# EAGLE design le_grand_strum (EAGLE 6.6.0)
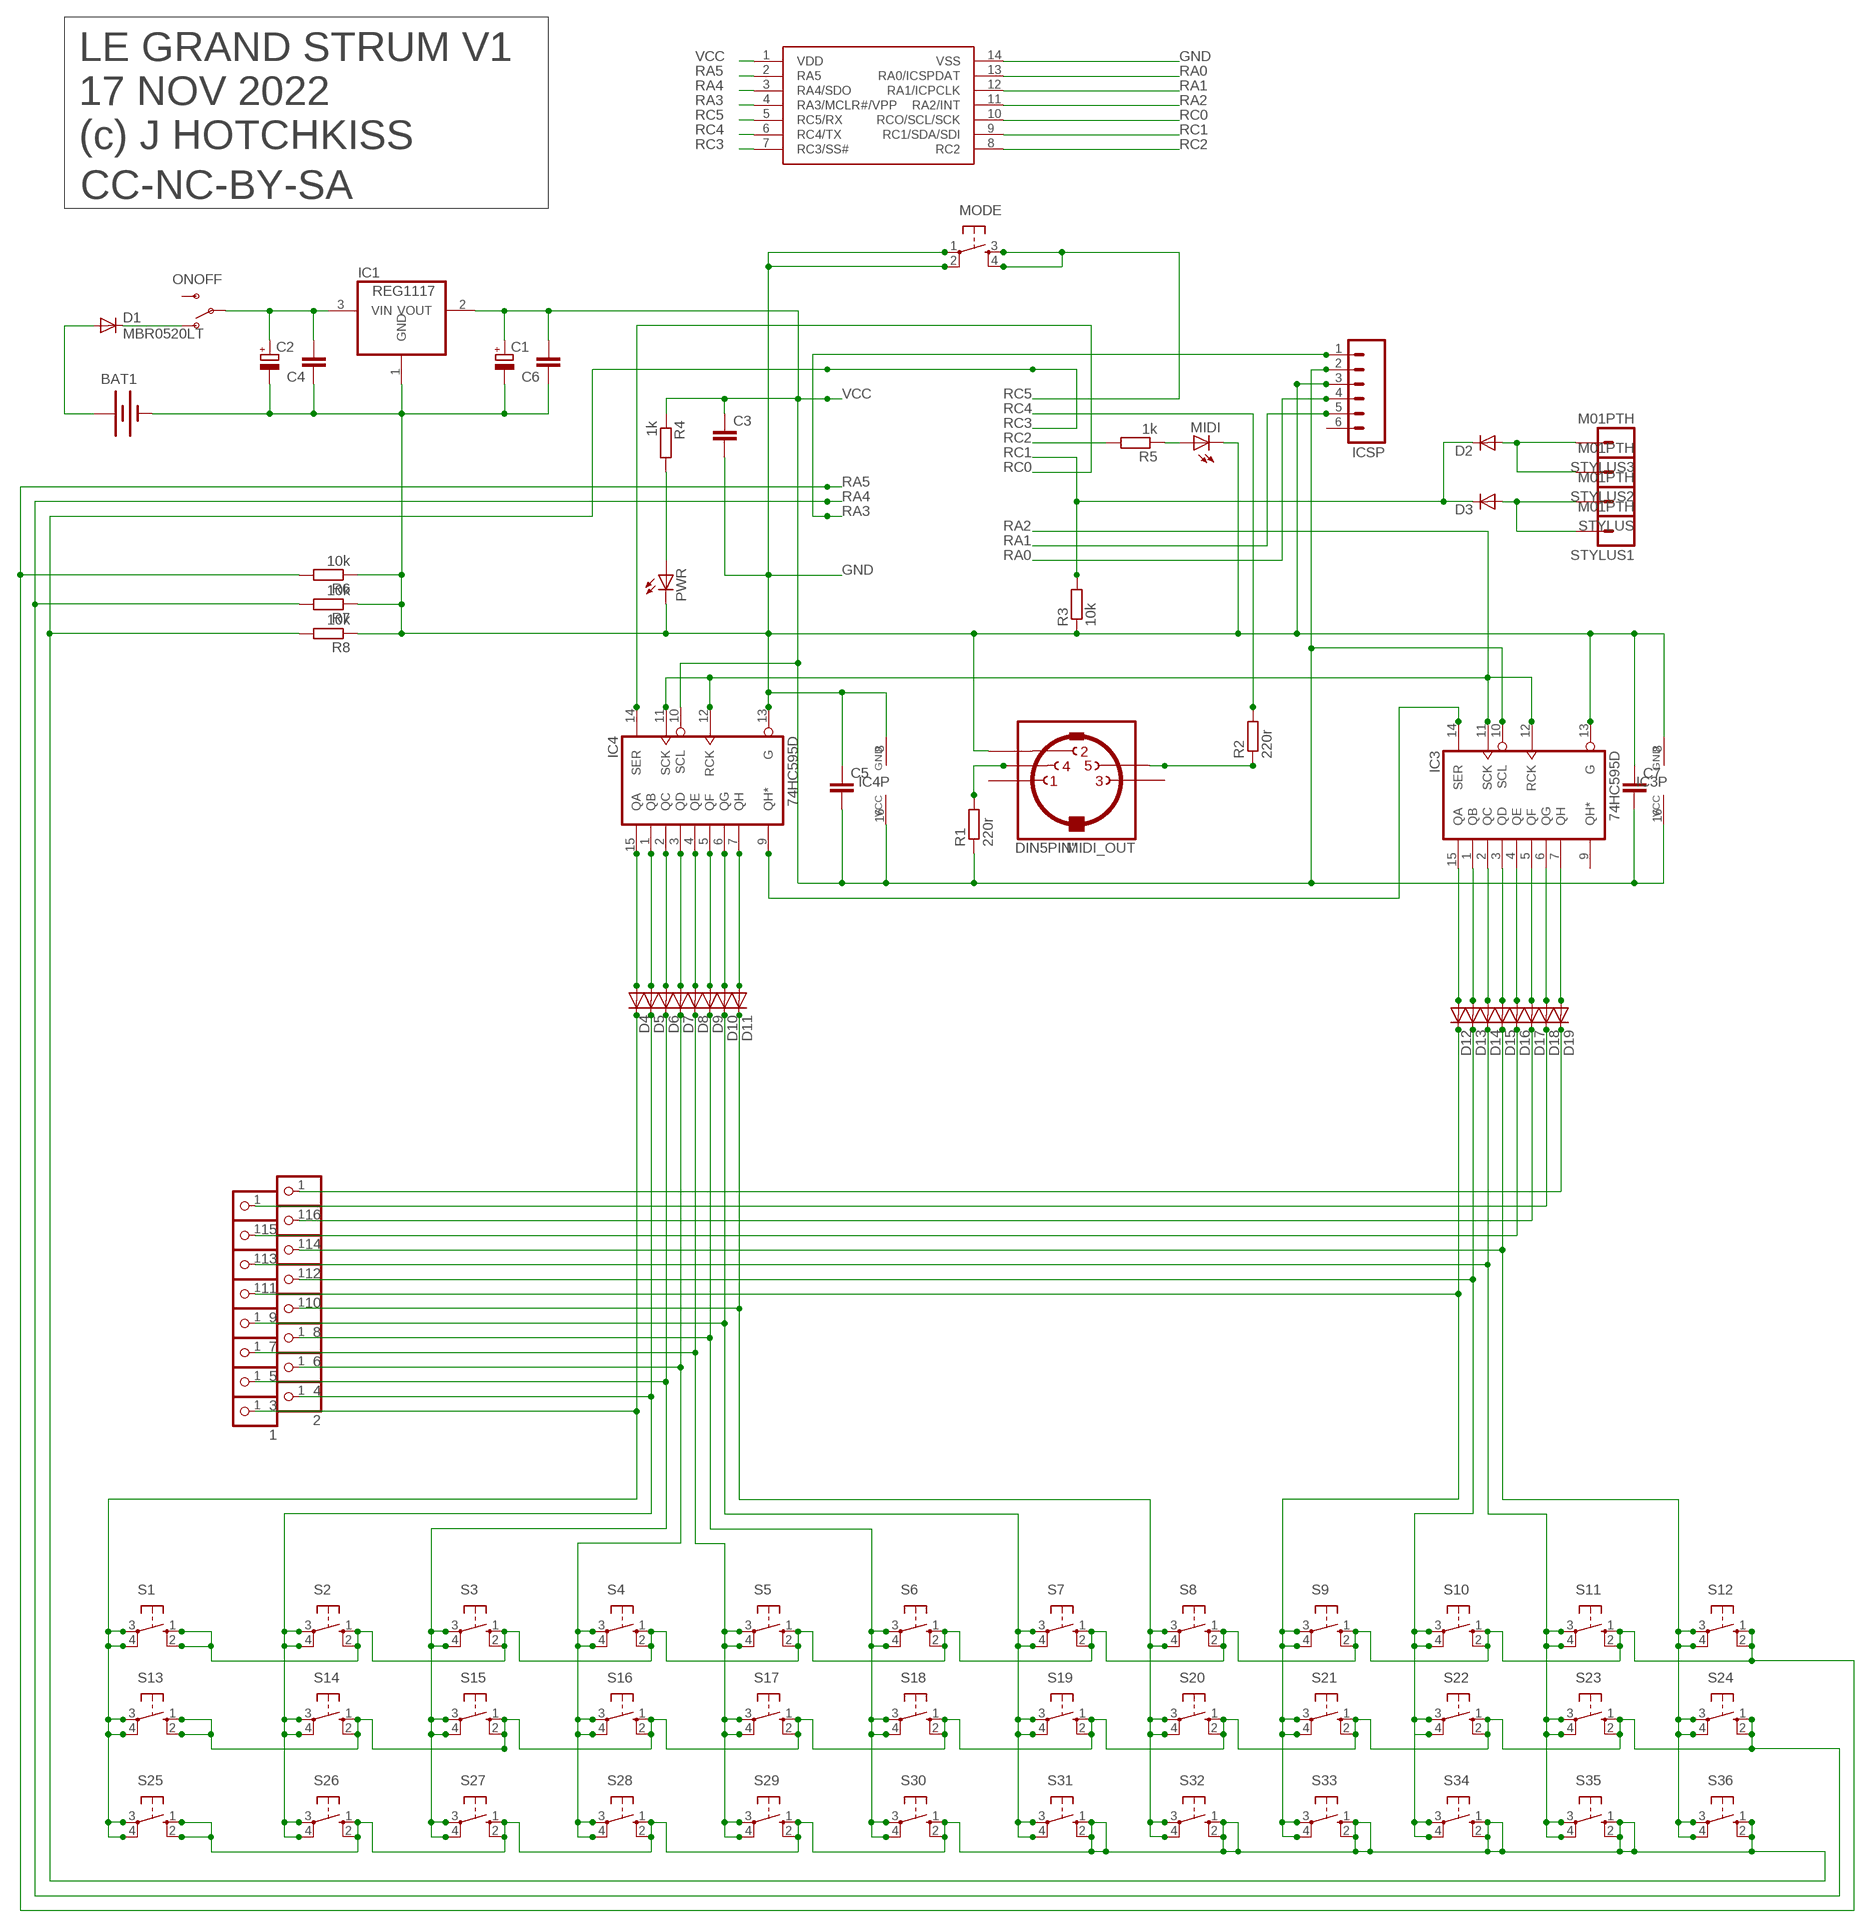
[diagram p0: schematic, sheet 1]

## Parts
1  PINHD-1X1  [1X01]
2  PINHD-1X1  [1X01]
3  PINHD-1X1  [1X01]
4  PINHD-1X1  [1X01]
5  PINHD-1X1  [1X01]
6  PINHD-1X1  [1X01]
7  PINHD-1X1  [1X01]
8  PINHD-1X1  [1X01]
9  PINHD-1X1  [1X01]
10  PINHD-1X1  [1X01]
11  PINHD-1X1  [1X01]
12  PINHD-1X1  [1X01]
13  PINHD-1X1  [1X01]
14  PINHD-1X1  [1X01]
15  PINHD-1X1  [1X01]
16  PINHD-1X1  [1X01]
BAT1  BATTERY2HOLES  [PP3_BATTERBOX2]
C1  CPOL-EUE2-5  [E2-5]
C2  CPOL-EUE2-5  [E2-5]
C3  C-EUC0805  [C0805]
C4  C-EUC0805  [C0805]
C5  C-EUC0805  [C0805]
C6  C-EUC0805  [C0805]
C7  C-EUC0805  [C0805]
D1  MBR0520LT  [SOD123]
D2  TS4148  [D0805]
D3  TS4148  [D0805]
D4  TS4148  [D0805]
D5  TS4148  [D0805]
D6  TS4148  [D0805]
D7  TS4148  [D0805]
D8  TS4148  [D0805]
D9  TS4148  [D0805]
D10  TS4148  [D0805]
D11  TS4148  [D0805]
D12  TS4148  [D0805]
D13  TS4148  [D0805]
D14  TS4148  [D0805]
D15  TS4148  [D0805]
D16  TS4148  [D0805]
D17  TS4148  [D0805]
D18  TS4148  [D0805]
D19  TS4148  [D0805]
IC1  REG1117  [SOT223]
IC2  PIC16F1825SO14  [SO14]
IC3  74HC595D  [SO16]
IC4  74HC595D  [SO16]
ICSP  M06SIP  [1X06]
MIDI  LEDCHIPLED_0805  [CHIPLED_0805]
MIDI_OUT  DIN5PIN"  [TRUCONN90]
MODE  TAC_SWITCHPTH  [TACTILE-PTH]
ONOFF  SWITCH-SPSTPTH  [SWITCH-SPDT]
PWR  LEDCHIPLED_0805  [CHIPLED_0805]
R1  220r  R-EU_R0805  [R0805]
R2  220r  R-EU_R0805  [R0805]
R3  10k  R-EU_R0805  [R0805]
R4  1k  R-EU_R0805  [R0805]
R5  1k  R-EU_R0805  [R0805]
R6  10k  R-EU_R0805  [R0805]
R7  10k  R-EU_R0805  [R0805]
R8  10k  R-EU_R0805  [R0805]
S1  40-XX  [B3F-40XX]
S2  40-XX  [B3F-40XX]
S3  40-XX  [B3F-40XX]
S4  40-XX  [B3F-40XX]
S5  40-XX  [B3F-40XX]
S6  40-XX  [B3F-40XX]
S7  40-XX  [B3F-40XX]
S8  40-XX  [B3F-40XX]
S9  40-XX  [B3F-40XX]
S10  40-XX  [B3F-40XX]
S11  40-XX  [B3F-40XX]
S12  40-XX  [B3F-40XX]
S13  40-XX  [B3F-40XX]
S14  40-XX  [B3F-40XX]
S15  40-XX  [B3F-40XX]
S16  40-XX  [B3F-40XX]
S17  40-XX  [B3F-40XX]
S18  40-XX  [B3F-40XX]
S19  40-XX  [B3F-40XX]
S20  40-XX  [B3F-40XX]
S21  40-XX  [B3F-40XX]
S22  40-XX  [B3F-40XX]
S23  40-XX  [B3F-40XX]
S24  40-XX  [B3F-40XX]
S25  40-XX  [B3F-40XX]
S26  40-XX  [B3F-40XX]
S27  40-XX  [B3F-40XX]
S28  40-XX  [B3F-40XX]
S29  40-XX  [B3F-40XX]
S30  40-XX  [B3F-40XX]
S31  40-XX  [B3F-40XX]
S32  40-XX  [B3F-40XX]
S33  40-XX  [B3F-40XX]
S34  40-XX  [B3F-40XX]
S35  40-XX  [B3F-40XX]
S36  40-XX  [B3F-40XX]
STYLUS  M01PTH  [1X01]
STYLUS1  M01PTH  [1X01]
STYLUS2  M01PTH  [1X01]
STYLUS3  M01PTH  [1X01]

## Nets
CARRY: IC3.14(SER) IC4.9(QH*)
GND: BAT1.0V(-) C1.- C2.- C3.2 C4.1 C5.1 C6.1 C7.1 IC1.1(GND) IC2.14(VSS) IC3.8(GND) IC3.13(G) IC4.8(GND) IC4.13(G) ICSP.3 MIDI.C MIDI_OUT.2 MODE.1 MODE.2 PWR.C R3.1 R6.1 R7.1 R8.1
LINE1: 1.1 D4.K(C) S1.3(P) S1.4(P1) S13.3(P) S13.4(P1) S25.3(P) S25.4(P1)
LINE2: 2.1 D5.K(C) S2.3(P) S2.4(P1) S14.3(P) S14.4(P1) S26.3(P) S26.4(P1)
LINE3: 3.1 D6.K(C) S3.3(P) S3.4(P1) S15.3(P) S15.4(P1) S27.3(P) S27.4(P1)
LINE4: 4.1 D7.K(C) S4.3(P) S4.4(P1) S16.3(P) S16.4(P1) S28.3(P) S28.4(P1)
LINE5: 5.1 D8.K(C) S5.3(P) S5.4(P1) S17.3(P) S17.4(P1) S29.3(P) S29.4(P1)
LINE6: 6.1 D9.K(C) S6.3(P) S6.4(P1) S18.3(P) S18.4(P1) S30.3(P) S30.4(P1)
LINE7: 7.1 D10.K(C) S7.3(P) S7.4(P1) S19.3(P) S19.4(P1) S31.3(P) S31.4(P1)
LINE8: 8.1 D11.K(C) S8.3(P) S8.4(P1) S20.3(P) S20.4(P1) S32.3(P) S32.4(P1)
LINE9: 9.1 D12.K(C) S9.3(P) S9.4(P1) S21.3(P) S21.4(P1) S33.3(P) S33.4(P1)
LINE10: 10.1 D13.K(C) S10.3(P) S10.4(P1) S22.3(P) S22.4(P1) S34.3(P) S34.4(P1)
LINE11: 11.1 D14.K(C) S11.3(P) S11.4(P1) S23.3(P) S23.4(P1) S35.3(P) S35.4(P1)
LINE12: 12.1 D15.K(C) S12.3(P) S12.4(P1) S24.3(P) S24.4(P1) S36.3(P) S36.4(P1)
LINE13: 13.1 D16.K(C)
LINE14: 14.1 D17.K(C)
LINE15: 15.1 D18.K(C)
LINE16: 16.1 D19.K(C)
N$1: PWR.A R4.2
N$2: BAT1.9V(+) D1.A
N$3: D1.C ONOFF.1(O)
N$5: D4.A IC4.15(QA)
N$6: D5.A IC4.1(QB)
N$7: D6.A IC4.2(QC)
N$8: D7.A IC4.3(QD)
N$9: D8.A IC4.4(QE)
N$10: D9.A IC4.5(QF)
N$11: D10.A IC4.6(QG)
N$12: MIDI.A R5.1
N$13: D11.A IC4.7(QH)
N$14: D12.A IC3.15(QA)
N$15: D13.A IC3.1(QB)
N$16: D14.A IC3.2(QC)
N$17: D15.A IC3.3(QD)
N$18: D16.A IC3.4(QE)
N$19: D17.A IC3.5(QF)
N$20: D18.A IC3.6(QG)
N$21: D19.A IC3.7(QH)
N$24: D2.A STYLUS2.1 STYLUS3.1
N$25: D3.A STYLUS1.1 STYLUS.1
N$44: MIDI_OUT.5 R2.1
N$48: MIDI_OUT.4 R1.2
N$59: C2.+ C4.2 IC1.3(VIN) ONOFF.2(P)
RA0: IC2.13(RA0/ICSPDAT) ICSP.4
RA1: IC2.12(RA1/ICPCLK) ICSP.5
RA2: IC2.11(RA2/INT) IC3.11(SCK) IC3.12(RCK) IC4.11(SCK) IC4.12(RCK)
RA3: IC2.4(RA3/MCLR#/VPP) ICSP.1
RA4: IC2.3(RA4/SDO) R7.2 S13.1(S) S13.2(S1) S14.1(S) S14.2(S1) S15.1(S) S15.2(S1) S16.1(S) S16.2(S1) S17.1(S) S17.2(S1) S18.1(S) S18.2(S1) S19.1(S) S19.2(S1) S20.1(S) S20.2(S1) S21.1(S) S21.2(S1) S22.1(S) S22.2(S1) S23.1(S) S23.2(S1) S24.1(S) S24.2(S1)
RA5: IC2.2(RA5) R6.2 S1.1(S) S1.2(S1) S2.1(S) S2.2(S1) S3.1(S) S3.2(S1) S4.1(S) S4.2(S1) S5.1(S) S5.2(S1) S6.1(S) S6.2(S1) S7.1(S) S7.2(S1) S8.1(S) S8.2(S1) S9.1(S) S9.2(S1) S10.1(S) S10.2(S1) S11.1(S) S11.2(S1) S12.1(S) S12.2(S1)
RC0: IC2.10(RCO/SCL/SCK) IC4.14(SER)
RC1: D2.K(C) D3.K(C) IC2.9(RC1/SDA/SDI) R3.2
RC2: IC2.8(RC2) R5.2
RC3: IC2.7(RC3/SS#) R8.2 S25.1(S) S25.2(S1) S26.1(S) S26.2(S1) S27.1(S) S27.2(S1) S28.1(S) S28.2(S1) S29.1(S) S29.2(S1) S30.1(S) S30.2(S1) S31.1(S) S31.2(S1) S32.1(S) S32.2(S1) S33.1(S) S33.2(S1) S34.1(S) S34.2(S1) S35.1(S) S35.2(S1) S36.1(S) S36.2(S1)
RC4: IC2.6(RC4/TX) R2.2
RC5: IC2.5(RC5/RX) MODE.3 MODE.4
VCC: C1.+ C3.1 C5.2 C6.2 C7.2 IC1.2(VOUT) IC2.1(VDD) IC3.10(SCL) IC3.16(VCC) IC4.10(SCL) IC4.16(VCC) ICSP.2 R1.1 R4.1
Unconnected: IC3.9(QH*) ICSP.6 MIDI_OUT.1 MIDI_OUT.3 ONOFF.3(S)

## Notes on the sheet
- LE GRAND STRUM V1
- 17 NOV 2022
- (c) J HOTCHKISS
- CC-NC-BY-SA

## Library data of the parts
1-16 = pinhead:PINHD-1X1: PIN HEADER
BAT1 = jasons_stuff:BATTERY: Battery Holders Various common sizes : AA, AAA, 20mm coin cell and 12mm coin cell.
C1 C2 = rcl:CPOL-EU: POLARIZED CAPACITOR, European symbol
C3-C7 = rcl:C-EU: CAPACITOR, European symbol
D1 = diode:MBR0520LT: SCHOTTKY BARRIER RECTIFIER Source: http://onsemi.com .. MBR0520LT1-D.pdf
D2-D19 = jason_eagle6:TS4148
IC1 = burr-brown:REG1117: 800mA and 1A Low Dropout (LDO) Positive Regulator 1.8V, 2.5V, 2.85V, 3.3V, 5V, and Adj; MPN: REG1117; OC_FARNELL: 1097566; OC_NEWARK: 14P6981
IC2 = jasons_stuff:PIC16F1825
IC3 IC4 = 74xx-eu:74*595: 8-bit SHIFT REGISTER, output latch
ICSP = SparkFun:M06: Header 6 Standard 6-pin 0.1" header. Use with straight break away headers (SKU : PRT-00116), right angle break away headers (PRT-00553), swiss pins (PRT-00743), machine pins (PRT-00117), and female headers (PRT-00115). Molex polarized connector foot print use with SKU : PRT-08094 with associated crimp pins and housings. NOTES ON THE VARIANTS LOCK and LOCK_LONGPADS... This footprint was designed to help hold the alignment of a through-hole component (i.e. 6-pin header) while soldering it into place. You may notice that each hole has been shifted either up or down by 0.005 of an inch from it's more standard position (which is a perfectly straight line). This slight alteration caused the pins (the squares in the middle) to touch the edges of the holes. Because they are alternating, it causes a "brace" to hold the component in place. 0.005 has proven to be the perfect amount of "off-center" position when using our standard breakaway headers. Although looks a little odd when you look at the bare footprint, once you have a header in there, the alteration is very hard to notice. Also, if you push a header all the way into place, it is covered up entirely on the bottom side. This idea of altering the position of holes to aid alignment will be further integrated into the Sparkfun Library for other footprints. It can help hold any component with 3 or more connection pins.
MIDI PWR = led:LED: LED OSRAM: - CHIPLED LG R971, LG N971, LY N971, LG Q971, LY Q971, LO R971, LY R971 LH N974, LH R974 LS Q976, LO Q976, LY Q976 LO Q996 - Hyper CHIPLED LW Q18S LB Q993, LB Q99A, LB R99A - SideLED LS A670, LO A670, LY A670, LG A670, LP A670 LB A673, LV A673, LT A673, LW A673 LH A674 LY A675 LS A676, LA A676, LO A676, LY A676, LW A676 LS A679, LY A679, LG A679 - Hyper Micro SIDELED® LS Y876, LA Y876, LO Y876, LY Y876 LT Y87S - SmartLED LW L88C, LW L88S LB L89C, LB L89S, LG L890 LS L89K, LO L89K, LY L89K LS L896, LA L896, LO L896, LY L896 - TOPLED LS T670, LO T670, LY T670, LG T670, LP T670 LSG T670, LSP T670, LSY T670, LOP T670, LYG T670 LG T671, LOG T671, LSG T671 LB T673, LV T673, LT T673, LW T673 LH T674 LS T676, LA T676, LO T676, LY T676, LB T676, LH T676, LSB T676, LW T676 LB T67C, LV T67C, LT T67C, LS T67K, LO T67K, LY T67K, LW E67C LS E67B, LA E67B, LO E67B, LY E67B, LB E67C, LV E67C, LT E67C LW T67C LS T679, LY T679, LG T679 LS T770, LO T770, LY T770, LG T770, LP T770 LB T773, LV T773, LT T773, LW T773 LH T774 LS E675, LA E675, LY E675, LS T675 LS T776, LA T776, LO T776, LY T776, LB T776 LHGB T686 LT T68C, LB T68C - Hyper Mini TOPLED® LB M676 - Mini TOPLED Santana® LG M470 LS M47K, LO M47K, LY M47K Source: http://www.osram.convergy.de LUXEON: - LUMILED® LXK2-PW12-R00, LXK2-PW12-S00, LXK2-PW14-U00, LXK2-PW14-V00 LXK2-PM12-R00, LXK2-PM12-S00, LXK2-PM14-U00 LXK2-PE12-Q00, LXK2-PE12-R00, LXK2-PE12-S00, LXK2-PE14-T00, LXK2-PE14-U00 LXK2-PB12-K00, LXK2-PB12-L00, LXK2-PB12-M00, LXK2-PB14-N00, LXK2-PB14-P00, LXK2-PB14-Q00 LXK2-PR12-L00, LXK2-PR12-M00, LXK2-PR14-Q00, LXK2-PR14-R00 LXK2-PD12-Q00, LXK2-PD12-R00, LXK2-PD12-S00 LXK2-PH12-R00, LXK2-PH12-S00 LXK2-PL12-P00, LXK2-PL12-Q00, LXK2-PL12-R00 Source: www.luxeon.com KINGBRIGHT: KA-3528ASYC Source: www.kingbright.com
MIDI_OUT = jasons_stuff:DIN5PIN: Female CONNECTOR 5 pins 90 deg. with shield, horizontal (DIN 41524)
MODE = SparkFun:TAC_SWITCH: Momentary Switch Button commonly used for reset or general input. Spark Fun Electronics SKU : COM-00097
ONOFF = SparkFun:SWITCH-SPST: SPST Switch Simple slide switch. Spark Fun Electronics SKU : COM-00102
R1-R8 = resistor:R-EU_: RESISTOR, European symbol
S1-S36 = switch-omron:40-XX: OMRON SWITCH; MF: OMRON COMPONENTS USA; MPN: B3F-4000; OC_FARNELL: 176434; OC_NEWARK: 36K3105
STYLUS STYLUS1-STYLUS3 = SparkFun:M01: Header 1 Standard 1-pin 0.1" header. Use with straight break away headers (SKU : PRT-00116), right angle break away headers (PRT-00553), swiss pins (PRT-00743), machine pins (PRT-00117), and female headers (PRT-00115).

## Board
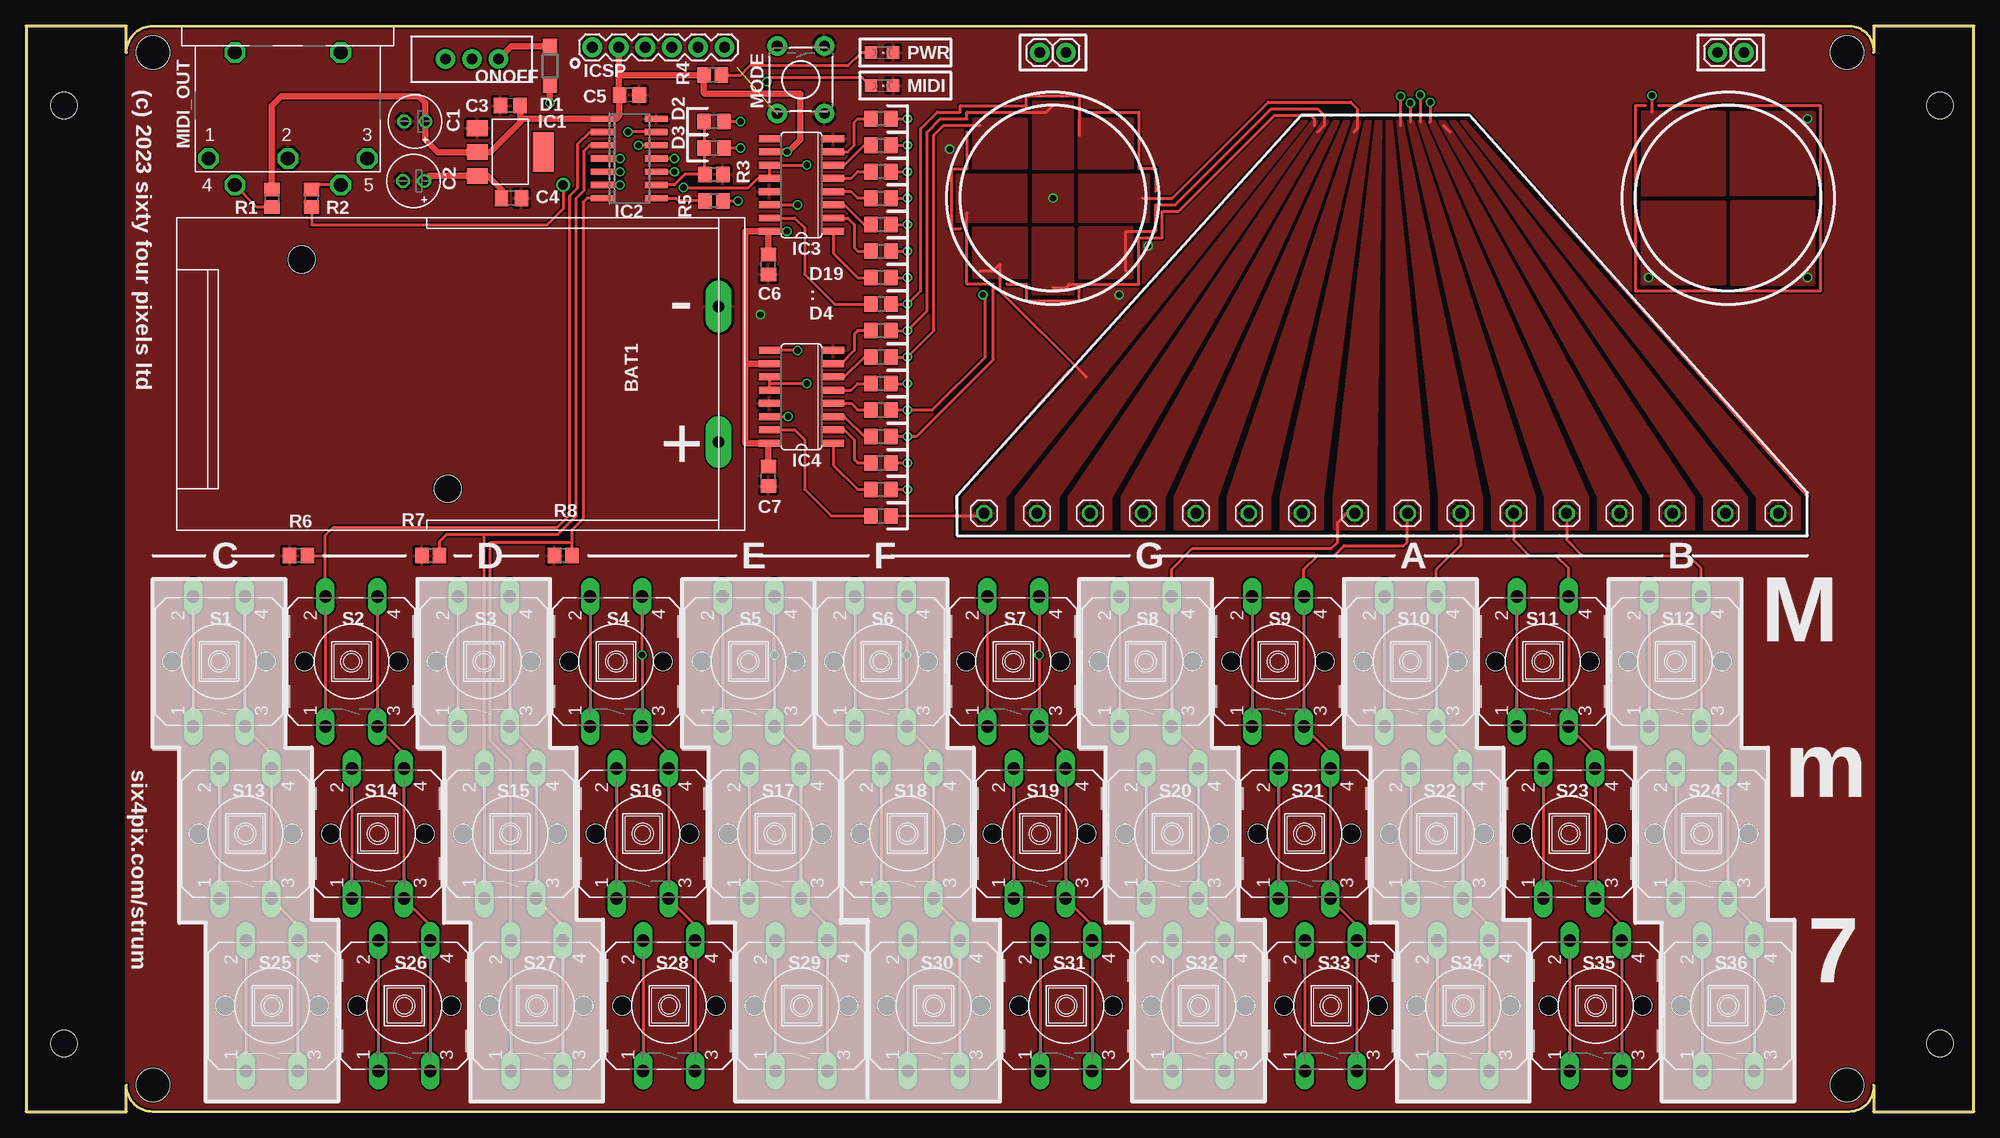
[diagram p1: board, top side]
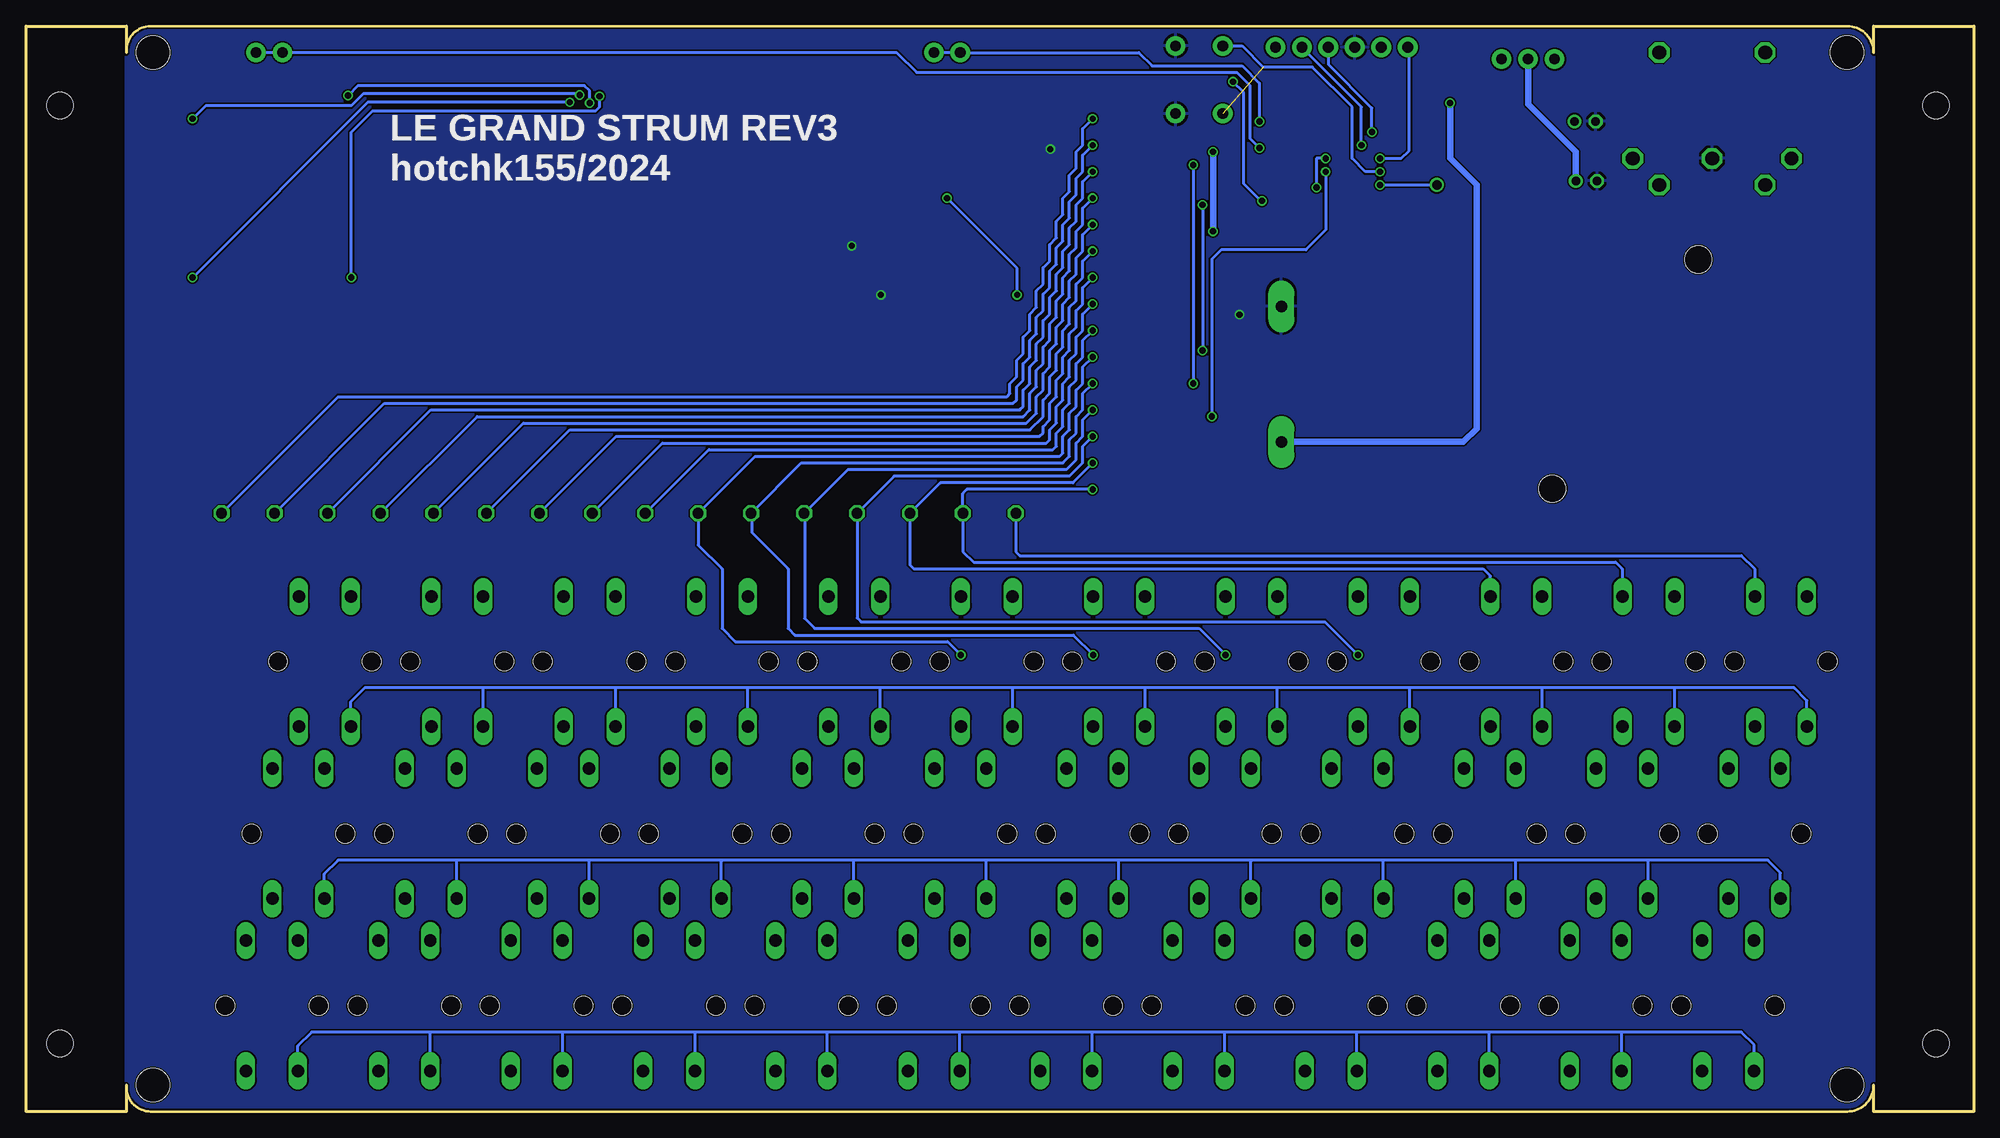
[diagram p2: board, bottom side, seen from below]

Size 186.88 x 104.15 mm. Coordinates in mm from the lower left corner, seen from the top.
Outline: 177.26,2.23 arc-90 174.72,0 12.16,0 arc-90 9.62,2.54 9.62,0 0,0 0,104.14 9.62,104.14 9.62,101.6 arc-90 12.16,104.14 174.72,104.14 arc-90 177.26,101.92
Outline: 177.26,2.54 177.26,0 186.88,0 186.88,104.14 177.26,104.14 177.26,101.6
Copper layers (1*16): Top 0.035mm / dielectric 1.5mm / Bottom 0.035mm
Design rules "hackvana": minimum track width 6mil, minimum drill 0.3mm, track to track 6mil, track to pad 9mil, pad to pad 6mil, via to via 6mil, smd to smd 0mil, copper to edge 6mil, drill to drill 6mil, minimum pad ring 10mil, minimum via ring 6mil, stop-mask expansion 2mil, vias tented up to drill 100mil, thermal gap 10mil
Holes 3.2 mm at 12.16,2.54 12.16,101.6 174.72,101.6 174.72,2.54
Holes 2.54 mm at 3.62,96.54 183.62,96.54 3.62,6.54 183.62,6.54

### Footprints (pad centres in the part's own frame; a part is rotated, then mirrored left to right if it is on the bottom)
1X01 = drill 1.016 octagon: 1 0,0
PP3_BATTERBOX2 = drill 1.1 pad 2.5 long: 0V 52,21.5; 9V 52,8.5 | hole 2.6: 12,26; 26,4
E2-5 = drill 0.813 pad 1.27: + -1.016,0 | drill 0.813 pad 1.27 octagon: - 1.016,0
C0805 = smd 1.3 x 1.5: 1 -0.95,0; 2 0.95,0
SOD123 = smd 1.4 x 1.4: A 1.9,0; C -1.9,0
D0805 = smd 1.3 x 1.5: A -0.95,0; K 0.95,0
SOT223 = smd 1.499 x 2.007: 1 -2.261,-3.15; 2 0.025,-3.15; 3 2.311,-3.15 | smd 3.81 x 2.007: 4 0,3.15
SO14 = smd 0.6 x 2.2: 1 -3.81,-2.6; 2 -2.54,-2.6; 3 -1.27,-2.6; 4 0,-2.6; 5 1.27,-2.6; 6 2.54,-2.6; 7 3.81,-2.6; 8 3.81,2.6; 9 2.54,2.6; 10 1.27,2.6; 11 0,2.6; 12 -1.27,2.6; 13 -2.54,2.6; 14 -3.81,2.6
SO16 = smd 0.66 x 2.032: 1 -4.445,-3.073; 2 -3.175,-3.073; 3 -1.905,-3.073; 4 -0.635,-3.073; 5 0.635,-3.073; 6 1.905,-3.073; 7 3.175,-3.073; 8 4.445,-3.073; 9 4.445,3.073; 10 3.175,3.073; 11 1.905,3.073; 12 0.635,3.073; 13 -0.635,3.073; 14 -1.905,3.073; 15 -3.175,3.073; 16 -4.445,3.073
1X06 = drill 1.016 pad 1.88: 1 0,0; 2 2.54,0; 3 5.08,0; 4 7.62,0; 5 10.16,0; 6 12.7,0
CHIPLED_0805 = smd 1.2 x 1.2: A 0,-1.05; C 0,1.05
TRUCONN90 = drill 1.321 octagon: 1 7.62,5.08; 2 0,5.08; 3 -7.62,5.08; 4 5.08,7.62; 5 -5.08,7.62; NC -5.08,-5.08; NC@ 5.08,-5.08
TACTILE-PTH = drill 1.016 pad 1.88: 1 -3.251,2.261; 2 3.251,2.261; 3 -3.251,-2.261; 4 3.251,-2.261
SWITCH-SPDT = drill 1.016 pad 1.88: 1 0,2.54; 2 0,0; 3 0,-2.54
R0805 = smd 1.3 x 1.5: 1 -0.85,0; 2 0.85,0
B3F-40XX = drill 1.194 long: 1 -6.248,2.489; 2 6.248,2.489; 3 -6.248,-2.489; 4 6.248,-2.489 | hole 1.803: 0,-4.496; 0,4.496
1X01' = drill 1.016 pad 1.88: 1 0,0

### Placement (x,y rotation side)
1  91.92,57.41 0 top
2  97,57.41 0 top
3  102.08,57.41 0 top
4  107.16,57.41 0 top
5  112.24,57.41 0 top
6  117.32,57.41 0 top
7  122.4,57.41 0 top
8  127.48,57.41 0 top
9  132.56,57.41 0 top
10  137.64,57.41 0 top
11  142.72,57.41 0 top
12  147.8,57.41 0 top
13  152.88,57.41 0 top
14  157.96,57.41 0 top
15  163.04,57.41 0 top
16  168.12,57.41 0 top
BAT1  14.45,55.76 0 top
C1  37.31,95 180 top
C2  37.18,89.29 180 top
C3  46.45,96.52 180 top
C4  46.58,87.63 180 top
C5  57.88,97.54 180 top
C6  71.22,81.28 90 top
C7  71.22,60.96 90 top
D1  50.26,100.33 270 top
D2  66.01,95 180 top
D3  66.01,92.46 180 top
D4  82.01,57.15 0 top
D5  82.01,59.69 0 top
D6  82.01,62.23 0 top
D7  82.01,64.77 0 top
D8  82.01,67.31 0 top
D9  82.01,69.85 0 top
D10  82.01,72.39 0 top
D11  82.01,74.93 0 top
D12  82.01,77.47 0 top
D13  82.01,80.01 0 top
D14  82.01,82.55 0 top
D15  82.01,85.09 0 top
D16  82.01,87.63 0 top
D17  82.01,90.17 0 top
D18  82.01,92.71 0 top
D19  82.01,95.25 0 top
IC1  46.45,92.08 270 top
IC2  57.88,91.45 270 top
IC3  74.39,88.9 90 top
IC4  74.39,68.58 90 top
ICSP  54.32,102.11 0 top
MIDI  82.14,98.43 270 top
MIDI_OUT  25.11,96.52 180 top
MODE  74.33,99 270 top
ONOFF  42.77,100.97 270 top
PWR  82.14,101.6 270 top
R1  23.59,87.63 270 top
R2  27.4,87.63 270 top
R3  66.01,89.92 180 top
R4  65.88,99.45 0 top
R5  66.01,87.38 180 top
R6  26.13,53.34 0 top
R7  38.83,53.34 0 top
R8  51.53,53.34 0 top
S1  18.51,43.18 90 top
S2  31.21,43.18 90 top
S3  43.91,43.18 90 top
S4  56.61,43.18 90 top
S5  69.31,43.18 90 top
S6  82.01,43.18 90 top
S7  94.71,43.18 90 top
S8  107.41,43.18 90 top
S9  120.11,43.18 90 top
S10  132.81,43.18 90 top
S11  145.51,43.18 90 top
S12  158.21,43.18 90 top
S13  21.05,26.67 90 top
S14  33.75,26.67 90 top
S15  46.45,26.67 90 top
S16  59.15,26.67 90 top
S17  71.85,26.67 90 top
S18  84.55,26.67 90 top
S19  97.25,26.67 90 top
S20  109.95,26.67 90 top
S21  122.65,26.67 90 top
S22  135.35,26.67 90 top
S23  148.05,26.67 90 top
S24  160.75,26.67 90 top
S25  23.59,10.16 90 top
S26  36.29,10.16 90 top
S27  48.99,10.16 90 top
S28  61.69,10.16 90 top
S29  74.39,10.16 90 top
S30  87.09,10.16 90 top
S31  99.79,10.16 90 top
S32  112.49,10.16 90 top
S33  125.19,10.16 90 top
S34  137.89,10.16 90 top
S35  150.59,10.16 90 top
S36  163.29,10.16 90 top
STYLUS  M01PTH  [1X01']  162.27,101.6 0 top
STYLUS1  M01PTH  [1X01']  164.81,101.6 0 top
STYLUS2  M01PTH  [1X01']  99.79,101.6 0 top
STYLUS3  M01PTH  [1X01']  97.25,101.6 0 top

### Tracks (layer width: path | path; a pad name or v marks a point on that pad's centre or on a via)
CARRY  (via drill 0.6)
  Top 0.305: IC3.14 v74.01,87 | v74.01,73.03 IC4.9
  Bottom 0.305: v74.01,87 v74.01,73.03
GND  (via drill 0.6)
  other vias: 104.87,78.36 107.66,83.06 70.45,76.46 88.61,92.33
  pour Top: 9.62,104.14 9.62,0 177.26,0 177.26,104.14
  pour Bottom: 9.62,104.14 9.62,0 177.26,0 177.26,104.14
LINE1
  Top 0.305: D4.K 91.66,57.15 1.1 | 91.54,80.65 92.81,80.65 93.44,81.28 93.44,78.74 101.7,70.49 | S1.4 S1.3 23.54,34.4 S13.4 S13.3 26.08,17.89 S25.4 S25.3
  Bottom 0.305: 1.1 91.92,53.73 91.54,53.34 22.32,53.34 21,52.02 S1.4
  pour Top: 89.88,58.93 89.88,55.88 93.95,55.88 93.95,58.93 122.9,95 122.4,95
  pour Top: 90.9,84.78 95.98,84.78 95.98,80.01 90.9,80.01
LINE2  (via drill 0.6)
  Top 0.305: D5.K v84.55,59.69 | 123.6,94.62 123.6,95.25 123.29,95.57 119.79,95.57 110.59,86.36 109,86.36 109,83.82 106.78,83.82 106.78,79.38 100.11,79.38 99.79,79.06 98.52,79.06 | S2.4 S2.3 36.24,34.4 S14.4 S14.3 38.78,17.89 S26.4 S26.3
  Bottom 0.305: v84.55,59.69 96.62,59.69 97,59.31 2.1 97,53.73 95.98,52.71 34.38,52.71 33.75,52.07 33.75,49.48 S2.4
  pour Top: 94.96,58.93 94.96,55.88 99.03,55.88 99.03,58.93 123.92,95 123.41,95
  pour Top: 96.62,84.78 100.43,84.78 100.43,78.43 96.62,78.43
LINE3  (via drill 0.6)
  Top 0.305: D6.K v84.55,62.23 | 123.92,93.98 124.56,94.62 124.56,95.57 123.92,96.21 119.48,96.21 110.27,87 108.36,87 108.36,84.46 105.51,84.46 105.51,80.65 | S27.3 S27.4 51.48,17.89 S15.3 S15.4 48.94,34.4 S3.3 S3.4
  Bottom 0.305: v84.55,62.23 86.45,60.33 99.16,60.33 3.1 102.08,52.46 101.7,52.07 47.09,52.07 46.4,51.39 S3.4
  pour Top: 100.04,58.93 100.04,55.88 104.11,55.88 104.11,58.93 124.94,95 124.43,95
  pour Top: 101.06,84.78 101.06,80.01 106.14,80.01 106.14,84.78
LINE4  (via drill 0.6)
  Top 0.305: D7.K v84.55,64.77 85.44,64.77 92.81,72.14 92.81,79.38 90.27,79.38 90.27,86.24 | S28.3 S28.4 64.18,17.89 S16.3 S16.4 61.64,34.4 S4.3 v59.1,43.82 S4.4
  Bottom 0.305: v84.55,64.77 85.5,63.82 85.5,62.23 86.77,60.96 103.6,60.96 4.1 107.16,47.38 106.78,46.99 62.27,46.99 v59.1,43.82
  pour Top: 105.12,58.93 105.12,55.88 109.19,55.88 109.19,58.93 125.95,95 125.44,95
  pour Top: 95.98,85.41 95.98,89.86 89.31,89.86 89.31,85.41
LINE5  (via drill 0.6)
  Top 0.305: D8.K v84.55,67.31 86.96,67.31 92.04,72.39 92.04,78.11 v91.79,78.36 | S5.4 71.8,48.26 v71.8,43.82 S5.3 74.34,34.4 S17.4 S17.3 76.88,17.89 S29.4 S29.3
  Bottom 0.305: v84.55,67.31 85.5,66.36 85.5,64.77 86.14,64.14 86.14,62.55 87.09,61.6 108.05,61.6 5.1 112.17,57.34 112.17,47.31 111.22,46.36 74.34,46.36 v71.8,43.82 | v91.79,78.36 91.79,80.9 v98.52,87.63
  pour Top: 110.2,58.93 110.2,55.88 114.27,55.88 114.27,58.93 126.97,95 126.46,95
  pour Top: 96.62,89.86 96.62,85.41 100.43,85.41 100.43,89.86
LINE6  (via drill 0.6)
  Top 0.305: D9.K v84.55,69.85 | 107.09,87.63 109.95,87.63 119.16,96.84 127.09,96.84 127.73,96.21 127.73,94.3 127.41,93.98 | S6.4 v84.5,43.82 S6.3 87.04,34.4 S18.4 S18.3 89.58,17.89 S30.4 S30.3
  Bottom 0.305: v84.55,69.85 85.5,68.9 85.5,67.31 86.14,66.68 86.14,65.09 86.77,64.46 86.77,62.87 87.41,62.23 112.49,62.23 6.1 117.25,57.34 117.25,55.57 113.76,52.07 113.76,46.36 113.12,45.72 86.4,45.72 v84.5,43.82
  pour Top: 115.28,58.93 115.28,55.88 119.35,55.88 119.35,58.93 127.98,95 127.48,95
  pour Top: 101.06,89.86 101.06,85.41 107.73,85.41 107.73,89.86
LINE7  (via drill 0.6)
  Top 0.305: D10.K v84.55,72.39 87.09,74.93 87.09,93.67 88.04,94.62 91.54,94.62 | S7.4 v97.2,43.82 97.2,38.1 S7.3 99.74,34.4 S19.4 S19.3 102.28,17.89 S31.4 S31.3
  Bottom 0.305: v84.55,72.39 85.5,71.44 85.5,69.85 86.14,69.22 86.14,67.63 86.77,67 86.77,65.41 87.41,64.77 87.41,63.19 87.73,62.87 116.94,62.87 7.1 122.4,54.36 120.11,52.07 120.11,46.36 118.84,45.09 98.47,45.09 v97.2,43.82
  pour Top: 120.36,58.93 120.36,55.88 124.43,55.88 124.43,58.93 129,95 128.49,95
  pour Top: 95.98,90.49 90.9,90.49 90.9,95.25 95.98,95.25
LINE8  (via drill 0.6)
  Top 0.305: D11.K v84.55,74.93 86.45,76.84 86.45,93.98 87.73,95.25 90.27,95.25 90.27,95.89 97.89,95.89 98.52,96.52 | S32.3 S32.4 114.98,17.89 S20.3 S20.4 112.44,34.4 S8.3 S8.4 109.9,52.02 111.86,53.98 125.19,53.98 125.83,54.61 125.83,56.52 127.09,57.79
  Top 0.406: 8.1 127.48,56.9
  Bottom 0.305: 8.1 121.38,63.5 88.36,63.5 88.04,63.82 88.04,65.09 87.41,65.73 87.41,67.31 86.77,67.95 86.77,69.54 86.14,70.17 86.14,71.76 85.5,72.39 85.5,73.98 v84.55,74.93
  pour Top: 125.44,58.93 125.44,55.88 129.51,55.88 129.51,58.93 130.02,95 129.51,95
  pour Top: 96.62,90.49 100.43,90.49 100.43,96.84 96.62,96.84
LINE9  (via drill 0.6)
  Top 0.305: D12.K v84.55,77.47 85.82,78.74 85.82,94.3 87.41,95.89 89.63,95.89 89.63,96.52 95.98,96.52 95.98,97.48 101.06,97.48 101.06,93.67 | S33.3 S33.4 127.68,17.89 S21.3 S21.4 125.14,34.4 S9.3 S9.4 122.6,52.02 123.92,53.34 125.51,53.34 126.46,54.3 132.18,54.3 132.49,54.61 132.49,57.34 9.1
  Bottom 0.305: 9.1 125.83,64.14 89,64.14 88.68,64.46 88.68,65.41 88.04,66.04 88.04,67.63 87.41,68.27 87.41,69.85 86.77,70.49 86.77,72.08 86.14,72.71 86.14,74.3 85.5,74.93 85.5,76.52 v84.55,77.47
  pour Top: 130.52,95 130.52,55.88 134.59,55.88 134.59,58.93 131.03,95
  pour Top: 101.06,90.49 101.06,95.25 106.14,95.25 106.14,90.49
LINE10  (via drill 0.6)
  Top 0.305: D13.K v84.55,80.01 | v131.86,97.41 131.86,94.62 | S34.3 S34.4 140.38,17.89 S22.3 S22.4 137.84,34.4 S10.3 S10.4 135.3,52.02 137.64,54.36 10.1
  Bottom 0.305: 10.1 130.27,64.77 89.63,64.77 89.31,65.09 89.31,65.73 88.68,66.36 88.68,67.95 88.04,68.58 88.04,70.17 87.41,70.81 87.41,72.39 86.77,73.03 86.77,74.62 86.14,75.25 86.14,76.84 85.5,77.47 85.5,79.06 v84.55,80.01 | v155.67,80.01 155.67,93.98 153.64,96.02 132.24,96.02 131.86,96.4 v131.86,97.41
  pour Top: 135.6,58.93 135.6,55.88 139.67,55.88 139.67,58.93 132.05,95 131.54,95
  pour Top: 155.03,87.32 162.97,87.32 162.97,79.38 155.03,79.38
LINE11  (via drill 0.6)
  Top 0.305: D14.K v84.55,82.55 | v132.81,96.78 132.81,94.94 | v155.99,97.48 155.99,95.89 | S35.3 S35.4 153.08,17.89 S23.3 S23.4 150.54,34.4 S11.3 S11.4 148,52.13 146.78,53.34 144.24,53.34 142.72,54.87 11.1
  Bottom 0.305: 11.1 134.72,65.41 90.58,65.41 89.31,66.68 89.31,68.27 88.68,68.9 88.68,70.49 88.04,71.12 88.04,72.71 87.41,73.35 87.41,74.93 86.77,75.57 86.77,77.16 86.14,77.79 86.14,79.38 85.5,80.01 85.5,81.6 v84.55,82.55 | v132.81,96.78 132.81,97.92 133.32,98.43 155.03,98.43 v155.99,97.48
  pour Top: 140.68,58.93 140.68,55.88 144.75,55.88 144.75,58.93 133.06,95 132.56,95
  pour Top: 155.03,87.95 162.97,87.95 162.97,95.89 155.03,95.89
LINE12  (via drill 0.6)
  Top 0.305: D15.K v84.55,85.09 | v133.76,97.54 133.76,94.94 | S36.3 S36.4 165.78,17.89 S24.3 S24.4 163.24,34.4 S12.3 S12.4 160.7,52.13 159.48,53.34 149.32,53.34 147.8,54.87 12.1
  Bottom 0.305: 12.1 139.16,66.04 90.9,66.04 89.95,67 89.95,68.58 89.31,69.22 89.31,70.81 88.68,71.44 88.68,73.03 88.04,73.66 88.04,75.25 87.41,75.89 87.41,77.47 86.77,78.11 86.77,79.7 86.14,80.33 86.14,81.92 85.5,82.55 85.5,84.14 v84.55,85.09 | v170.91,95.25 169.64,96.52 155.67,96.52 154.53,97.67 133.83,97.67 133.76,97.6 v133.76,97.54
  pour Top: 145.76,58.93 145.76,55.88 149.83,55.88 149.83,58.93 134.08,95 133.57,95
  pour Top: 163.61,87.95 163.61,95.89 171.55,95.89 171.55,87.95
LINE13  (via drill 0.6)
  Top 0.305: D16.K v84.55,87.63 | v134.72,96.84 134.72,94.94
  Bottom 0.305: 13.1 143.61,66.68 91.22,66.68 90.58,67.31 90.58,68.9 89.95,69.54 89.95,71.12 89.31,71.76 89.31,73.35 88.68,73.98 88.68,75.57 88.04,76.2 88.04,77.79 87.41,78.43 87.41,80.01 86.77,80.65 86.77,82.24 86.14,82.87 86.14,84.46 85.5,85.09 85.5,86.68 v84.55,87.63 | v170.91,80.01 154.08,96.84 v134.72,96.84
  pour Top: 150.84,58.93 150.84,55.88 154.91,55.88 154.91,58.93 135.1,95 134.59,95
  pour Top: 163.61,87.32 163.61,79.38 171.55,79.38 171.55,87.32
LINE14  (via drill 0.6)
  Top 0.305: D17.K v84.55,90.17 | 135.98,94.62 136.62,93.98
  Bottom 0.305: 14.1 148.05,67.31 91.54,67.31 91.22,67.63 91.22,69.22 90.58,69.85 90.58,71.44 89.95,72.08 89.95,73.66 89.31,74.3 89.31,75.89 88.68,76.52 88.68,78.11 88.04,78.74 88.04,80.33 87.41,80.97 87.41,82.55 86.77,83.19 86.77,84.78 86.14,85.41 86.14,87 85.5,87.63 85.5,89.22 v84.55,90.17
  pour Top: 155.92,58.93 155.92,55.88 159.99,55.88 159.99,58.93 136.11,95 135.6,95
LINE15  (via drill 0.6)
  Top 0.305: D18.K v84.55,92.71
  Bottom 0.305: 15.1 152.5,67.95 92.17,67.95 91.85,68.27 91.85,69.54 91.22,70.17 91.22,71.76 90.58,72.39 90.58,73.98 89.95,74.62 89.95,76.2 89.31,76.84 89.31,78.43 88.68,79.06 88.68,80.65 88.04,81.28 88.04,82.87 87.41,83.51 87.41,85.09 86.77,85.73 86.77,87.32 86.14,87.95 86.14,89.54 85.5,90.17 85.5,91.76 v84.55,92.71
  pour Top: 161,58.93 161,55.88 165.07,55.88 165.07,58.93 137.13,95 136.62,95
LINE16  (via drill 0.6)
  Top 0.305: D19.K v84.55,95.25
  Bottom 0.305: 16.1 156.94,68.58 92.81,68.58 92.49,68.9 92.49,69.85 91.85,70.49 91.85,72.08 91.22,72.71 91.22,74.3 90.58,74.93 90.58,76.52 89.95,77.16 89.95,78.74 89.31,79.38 89.31,80.97 88.68,81.6 88.68,83.19 88.04,83.82 88.04,85.41 87.41,86.05 87.41,87.63 86.77,88.27 86.77,89.86 86.14,90.49 86.14,92.08 85.5,92.71 85.5,94.3 v84.55,95.25
  pour Top: 166.08,58.93 166.08,55.88 170.15,55.88 170.15,58.93 138.14,95 137.64,95
N$1
  Top 0.305: PWR.A 80.11,101.6 78.84,100.33 69.44,100.33 68.55,99.45 R4.2
N$2  (via drill 0.6)
  Top 0.61: D1.A v50.26,96.78
  Bottom 0.61: BAT1.9V 66.44,64.27 48.99,64.27 47.72,65.54 47.72,88.9 50.26,91.44 v50.26,96.78
N$3
  Top 0.61: D1.C 46.57,102.23 ONOFF.1
N$5
  Top 0.305: IC4.15 73.76,65.41 74.71,64.46 74.71,59.69 77.25,57.15 D4.A
N$6
  Top 0.305: IC4.1 77.46,62.02 79.79,59.69 D5.A
N$7
  Top 0.305: IC4.2 78.52,65.41 79.47,64.46 79.47,62.55 79.79,62.23 D6.A
N$8
  Top 0.305: IC4.3 78.52,66.68 80.42,64.77 D7.A
N$9
  Top 0.305: IC4.4 79.15,67.95 79.79,67.31 D8.A
N$10
  Top 0.305: IC4.5 79.15,69.22 79.79,69.85 D9.A
N$11
  Top 0.305: IC4.6 78.52,70.49 80.42,72.39 D10.A
N$12  (via drill 0.6)
  Top 0.305: 80.87,98.43 MIDI.A 80.99,98.43 80.23,99.19 71.47,99.19 v71.09,98.81 | R5.1 v68.29,87.38
  Bottom 0.305: v68.29,87.38 68.29,87.25 70.07,89.03 70.07,97.79 v71.09,98.81
N$13
  Top 0.305: D11.A 79.79,74.93 79.47,74.62 79.47,73.03 78.2,71.76 IC4.7
N$14
  Top 0.305: IC3.15 73.76,85.73 74.71,84.78 74.71,80.33 77.56,77.47 D12.A
N$15
  Top 0.305: IC3.1 77.46,82.34 79.79,80.01 D13.A
N$16
  Top 0.305: IC3.2 78.84,85.73 79.47,85.09 79.47,82.87 79.79,82.55 D14.A
N$17
  Top 0.305: D15.A 80.42,85.09 78.52,87 IC3.3
N$18
  Top 0.305: D16.A 79.79,87.63 79.15,88.27 IC3.4
N$19
  Top 0.305: IC3.5 79.15,89.54 79.79,90.17 D17.A
N$20
  Top 0.305: IC3.6 78.52,90.81 80.42,92.71 D18.A
N$21
  Top 0.305: IC3.7 78.84,92.08 79.47,92.71 79.47,94.94 79.79,95.25 D19.A
N$22
  Top 0.305: 90.27,93.98 90.27,90.43 88.74,90.43 88.74,84.71 89.63,84.71
N$23
  Top 0.305: 94.08,79.38 95.98,79.38 95.98,77.79 101.06,77.79 101.06,78.81
N$24  (via drill 0.6)
  Top 0.305: D2.A v68.55,95
  Bottom 0.305: v68.55,95 68.55,98.68 70.2,100.33 78.84,100.33 80.11,101.6 STYLUS3.1 STYLUS2.1
N$25  (via drill 0.6)
  Top 0.305: D3.A v68.55,92.46
  Bottom 0.305: STYLUS1.1 STYLUS.1 103.35,101.6 101.44,99.7 70.71,99.7 69.44,98.43 69.44,93.35 v68.55,92.46
N$26
  Top 0.305: 101.7,95.89 106.78,95.89 106.78,90.49 108.36,90.49 108.36,88.27
N$27
  Top 0.305: 155.35,96.52 154.4,96.52 154.4,78.74 172.18,78.74 172.18,96.52 156.62,96.52
N$28
  Top 0.305: 89.31,56.52 89.31,55.25 125.19,55.25
N$30
  Top 0.305: 126.46,55.25 131.86,55.25
N$31
  Top 0.305: 133.13,55.25 136.94,55.25
N$32
  Top 0.305: 138.21,55.25 142.02,55.25
N$33
  Top 0.305: 143.29,55.25 147.1,55.25
N$34
  Top 0.305: 148.37,55.25 170.91,55.25 170.91,59.06 138.53,95.57 135.29,95.57
N$35
  Top 0.305: 131.22,95.57 128.37,95.57
N$36
  Top 0.305: 127.09,95.57 125.19,95.57
N$37
  Top 0.305: 89.31,57.79 89.31,59.06 100.11,71.12
N$38
  Top 0.305: 101.06,72.08 121.7,94.94
N$44
  Top 0.305: MIDI_OUT.5 27.82,88.9 R2.1
N$48
  Top 0.305: R1.2 22.15,86.78 MIDI_OUT.4
N$59
  Top 0.61: C4.2 45.63,88.46 44.32,89.77 IC1.3 38.68,89.77 C2.+
  Bottom 0.61: C2.+ 38.2,92.08 42.77,96.65 ONOFF.2
RA0  (via drill 0.6)
  Top 0.305: IC2.13 v57.76,93.99 v57.75,93.98
  Bottom 0.305: ICSP.4 61.94,100.46 57.75,96.27 v57.75,93.98
RA1  (via drill 0.6)
  Top 0.305: IC2.12 v58.77,92.72 v58.77,92.71
  Bottom 0.305: v58.77,92.71 58.77,96.4 ICSP.5
RA2  (via drill 0.6)
  Top 0.305: v74.9,90.81 IC3.11 IC3.12 70.2,89.54 69.31,88.65 v63.09,88.65 | IC4.11 71.32,69.85 | 71.32,69.85 IC4.12 | v74.9,69.85 71.32,69.85 | IC2.11 v62.19,91.45 v62.2,91.44
  Bottom 0.305: v62.2,91.44 63.09,91.44 v63.09,88.65 | v74.9,90.81 v74.9,69.85
RA3  (via drill 0.6)
  Top 0.305: IC2.4 v56.99,91.45 v56.99,91.44
  Bottom 0.305: v56.99,91.44 54.96,91.44 54.2,92.21 54.2,101.99 ICSP.1
RA4
  Top 0.305: R7.2 39.68,54.7 40.35,55.38 43.91,55.38 | 43.91,55.38 51.02,55.38 52.8,57.15 52.8,87.63 53.56,88.4 53.56,92.21 54.07,92.71 IC2.3 | S13.2 S13.1 | S14.2 S14.1 | S15.1 S15.2 43.96,55.33 43.91,55.38 | S16.2 S16.1 | S17.2 S17.1 | S18.2 S18.1 | S19.2 S19.1 | S20.2 S20.1 | S21.2 S21.1 | S22.2 S22.1 | S23.2 S23.1 | S24.2 S24.1
  Bottom 0.305: S13.1 18.56,22.92 19.78,24.13 31.21,24.13 | 31.21,24.13 43.91,24.13 | 43.91,24.13 56.61,24.13 | 56.61,24.13 69.31,24.13 | 69.31,24.13 82.01,24.13 | 82.01,24.13 94.71,24.13 | 94.71,24.13 107.41,24.13 | 107.41,24.13 120.11,24.13 | 120.11,24.13 132.81,24.13 | 132.81,24.13 145.51,24.13 | 145.51,24.13 156.94,24.13 158.26,22.81 S24.1 | S23.1 145.56,24.08 145.51,24.13 | S22.1 132.86,24.08 132.81,24.13 | S21.1 120.16,24.08 120.11,24.13 | S20.1 107.46,24.08 107.41,24.13 | S19.1 94.76,24.08 94.71,24.13 | S18.1 82.06,24.08 82.01,24.13 | S17.1 69.36,24.08 69.31,24.13 | S16.1 56.66,24.08 56.61,24.13 | S15.1 43.96,24.08 43.91,24.13 | S14.1 31.26,24.08 31.21,24.13
RA5
  Top 0.305: IC2.2 54.07,93.98 52.93,92.84 52.93,88.65 52.16,87.89 52.16,57.28 50.89,56.01 29.43,56.01 28.72,55.3 28.72,53.34 | S1.2 S1.1 | S2.1 S2.2 28.72,53.34 | S3.2 S3.1 | S4.2 S4.1 | S5.2 S5.1 | S6.2 S6.1 | S7.2 S7.1 | S8.2 S8.1 | S9.2 S9.1 | S10.2 S10.1 | S11.2 S11.1 | S12.2 S12.1 | R6.2 28.72,53.34
  Bottom 0.305: S1.1 16.02,39.43 17.24,40.64 28.67,40.64 | 28.67,40.64 41.37,40.64 | 41.37,40.64 54.07,40.64 | 54.07,40.64 66.77,40.64 | 66.77,40.64 79.47,40.64 | 79.47,40.64 92.17,40.64 | 92.17,40.64 104.87,40.64 | 104.87,40.64 117.57,40.64 | 117.57,40.64 130.27,40.64 | 130.27,40.64 142.97,40.64 | 142.97,40.64 154.4,40.64 155.72,39.32 S12.1 | S11.1 143.02,40.59 142.97,40.64 | S10.1 130.32,40.59 130.27,40.64 | S9.1 117.62,40.59 117.57,40.64 | S8.1 104.92,40.59 104.87,40.64 | S7.1 92.22,40.59 92.17,40.64 | S6.1 79.52,40.59 79.47,40.64 | S5.1 66.82,40.59 66.77,40.64 | S4.1 54.12,40.59 54.07,40.64 | S3.1 41.42,40.59 41.37,40.64 | S2.1 28.72,40.59 28.67,40.64
RC0  (via drill 0.6)
  Top 0.305: IC2.10 v62.19,90.18 v62.2,90.17 | IC4.14 v73.12,66.68
  Bottom 0.305: v62.2,90.17 62.2,84.59 64.1,82.68 72.23,82.68 73.12,81.79 v73.12,66.68
RC1
  Top 0.305: IC2.9 62.2,88.9 63.21,89.92 R3.2 65.06,90.02 D3.K D2.K
RC2
  Top 0.305: IC2.8 62.32,87.64 62.58,87.38 R5.2
RC3
  Top 0.305: R8.2 52.38,54.61 | 52.38,54.61 52.38,55.85 53.43,56.9 53.43,87.25 53.82,87.64 IC2.7 | S25.2 S25.1 | S26.2 S26.1 | S27.1 S27.2 46.5,33.61 44.54,35.56 44.54,54.61 52.38,54.61 | S28.2 S28.1 | S29.2 S29.1 | S30.2 S30.1 | S31.2 S31.1 | S32.2 S32.1 | S33.2 S33.1 | S34.2 S34.1 | S35.2 S35.1 | S36.2 S36.1
  Bottom 0.305: S25.1 21.1,6.41 22.32,7.62 33.75,7.62 | 33.75,7.62 46.45,7.62 | 46.45,7.62 59.15,7.62 | 59.15,7.62 71.85,7.62 | 71.85,7.62 84.55,7.62 | 84.55,7.62 97.25,7.62 | 97.25,7.62 109.95,7.62 | 109.95,7.62 122.65,7.62 | 122.65,7.62 135.35,7.62 | 135.35,7.62 148.05,7.62 | 148.05,7.62 159.48,7.62 160.8,6.3 S36.1 | S35.1 148.1,7.57 148.05,7.62 | S34.1 135.4,7.57 135.35,7.62 | S33.1 122.7,7.57 122.65,7.62 | S32.1 110,7.57 109.95,7.62 | S31.1 97.3,7.57 97.25,7.62 | S30.1 84.6,7.57 84.55,7.62 | S29.1 71.9,7.57 71.85,7.62 | S28.1 59.2,7.57 59.15,7.62 | S27.1 46.5,7.57 46.45,7.62 | S26.1 33.8,7.57 33.75,7.62
RC4  (via drill 0.6, 0.9)
  Top 0.305: IC2.6 v56.99,88.91 v56.99,88.9 | R2.2 27.4,85.09 50.01,85.09 51.53,86.62 v51.53,88.9
  Bottom 0.305: v56.99,88.9 v51.53,88.9
RC5  (via drill 0.6)  (1 unrouted)
  Top 0.305: IC2.5 v56.99,90.18 v56.99,90.17
  Bottom 0.305: v56.99,90.17 58.39,90.17 59.66,91.44 59.66,96.4 63.47,100.21 68.17,100.21 70.21,102.25 MODE.3
VCC  (via drill 0.6)
  Top 0.61: 47.4,95.25 C3.1 47.53,96.4 | 47.4,95.25 47.4,94.93 44.52,92.05 IC1.2 39.49,92.05 38.32,93.22 C1.+ 38.32,96.78 37.69,97.41 24.48,97.41 23.59,96.52 R1.1 | ICSP.2 56.86,99.45 | 56.86,99.45 56.86,97.61 C5.2 56.93,95.57 56.61,95.25 IC2.1 47.4,95.25 | C6.2 71.22,84.36 IC3.16 | C7.2 71.22,64.04 IC4.16 68.99,64.14 68.99,71.76 | IC3.16 68.99,84.46 68.99,71.76 | IC4.10 68.99,71.76 | 56.86,99.45 R4.1 65.03,97.76 65.12,97.67 74.26,97.67 74.26,93.22 73.12,92.08 v72.99,92.08 IC3.10 | IC3.16 v72.99,84.46
  Bottom 0.61: v72.99,84.46 v72.99,92.08

### Text on the board
tPlace: (c) 2023 sixty four pixels ltd | D19 / : / D4 | C | D | E | F | G | A | B | M | six4pix.com/strum | m | 7
bPlace: LE GRAND STRUM REV3 / hotchk155/2024